# Altium schematic sheet Power.SchDoc
size A4; SheetNumber: 1; SheetTotal: 3
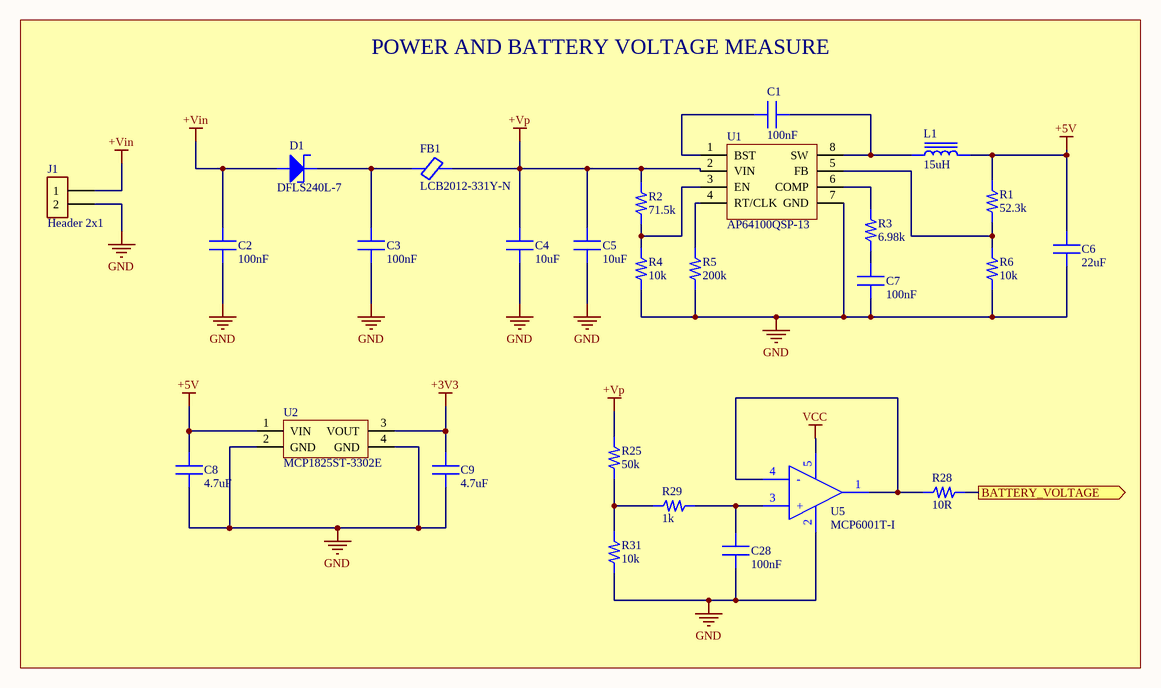
[diagram p0: Power.SchDoc]

## Parts
C1  100nF  [CAPC2012X145N 0805]
C2  100nF  [CAPC2012X145N 0805]
C3  100nF  [CAPC2012X145N 0805]
C4  10uF  [CAPC 1206 3216X180N]
C5  10uF  [CAPC 1206 3216X180N]
C6  22uF  [CAPC2012X145N 0805]
C7  100nF  [CAPC2012X145N 0805]
C8  4.7uF  [CAPC2012X145N 0805]
C9  4.7uF  [CAPC2012X145N 0805]
C28  100nF  [CAPC2012X145N 0805]
D1  DFLS240L-7  [DIODE DFLS240L-7  POWERDI 123]
FB1  LCB2012-331Y-N  [BEADC2012X105N MPZ2012S601ATD25]
J1  Header 2x1  [JST_B2B-PH-K-S 1x2 Header]
L1  15uH  [Inductor SRI1004-150M]
R1  52.3k  [RES 0805 YAGEO C2012X60N]
R2  71.5k  [RES 0805 YAGEO C2012X60N]
R3  6.98k  [RES 0805 YAGEO C2012X60N]
R4  10k  [RES 0805 YAGEO C2012X60N]
R5  200k  [RES 0805 YAGEO C2012X60N]
R6  10k  [RES 0805 YAGEO C2012X60N]
R25  50k  [RES 0805 YAGEO C2012X60N]
R28  10R  [RES 0805 YAGEO C2012X60N]
R29  1k  [RES 0805 YAGEO C2012X60N]
R31  10k  [RES 0805 YAGEO C2012X60N]
U1  AP64100QSP-13  [AP64100QSP-13 SOIC-8 Buck Converter]
U2  MCP1825ST-3302E  [LDO MCP1825ST-3302E/DB  SOT-223_3MC_MCH]
U5  MCP6001T-I  [MCP6001T-I/OT OPAMP SOT-23-5]

## Blocks framed on the sheet
POWER AND BATTERY VOLTAGE MEASURE: C1-C9 C28 D1 FB1 J1 L1 R1-R6 R25 R28 R29 R31 U1 U2 U5

## Ports
BATTERY_VOLTAGE (out, see MCU[1B])

## Nets
+3V3: C9.2 U2.3(VOUT)
+5V: C6.2 C8.2 L1.2 R1.2 U2.1(VIN)
+Vin: C2.2 D1.1(Anode) J1.1
+Vp: C4.2 C5.2 FB1.2 R2.2 R25.2 U1.2(VIN)
GND: C2.1 C3.1 C4.1 C5.1 C6.1 C7.1 C8.1 C9.1 C28.1 J1.2 R4.1 R5.1 R6.1 R31.1 U1.7(GND) U2.2(GND) U2.4(GND) U5.2(VSS)
VCC: U5.5(VDD)
BATTERY_VOLTAGE: R28.2 ; port BATTERY_VOLTAGE
NetC1_1: C1.1 U1.1(BST)
NetC1_2: C1.2 L1.1 U1.8(SW)
NetC3_2: C3.2 D1.2(Cathode) FB1.1
NetC7_2: C7.2 R3.1
NetC28_2: C28.2 R29.2 U5.3(+)
NetR1_1: R1.1 R6.2 U1.5(FB)
NetR2_1: R2.1 R4.2 U1.3(EN)
NetR3_2: R3.2 U1.6(COMP)
NetR5_2: R5.2 U1.4(RT/CLK)
NetR25_1: R25.1 R29.1 R31.2
NetR28_1: R28.1 U5.1(Vout) U5.4(-)

## Library data of the parts
C1 = CAP 0805 100nF: MLCC 0805 100nF 50VDC ±10% X7R; Manufacturer Code: CL21B104KBCNNNC; Manufacturer: SAMSUNG; Capacitance: 100nF; Voltage Rating: 50VDC; Dielectric: X7R; Package Size: 0805; Operating Temp.: -55 °C ~ +125 °C; Tolerance: ±10 %; Product Site: https://www.ozdisan.com/p/smt-smd-ve-mlcc-kapasitorler-184/samsung-cl21b104kbcnnnc-14777
C2 C3 C28 = CAP 0805 100nF CC0805JRX7R9BB104: MLCC 0805 100nF 50VDC ±10% X7R; Manufacturer: YAGEO; Tolerance: ±5 %; Capacitance: 100nF; Voltage Rating: 50VDC; Dielectric: X7R; Package Size: 0805; Operating Temp.: -55 °C ~ +125 °C; Manufacturer Code: CC0805JRX7R9BB104
  C2 C3: Product Site: https://www.ozdisan.com/p/smt-smd-ve-mlcc-kapasitorler-184/samsung-cl21b104kbcnnnc-14777
  C28: ComponentLink1Description: Product Site; ComponentLink1URL: https://www.ozdisan.com/p/smt-smd-ve-mlcc-kapasitorler-184/yageo-cc0805jrx7r9bb104-748830
C4 C5 = CAP 1206 10uF CL31A106KBHNNNE: MLCC (3216) 1206 10uF 50VDC ±10% X5R; Manufacturer: Samsung Electro-Mechanics; Manufacturer Product Number: CL31B225KCHSNNE; Package / Case: 1206; Operating Temperature: -55 °C ~ +85 °C; Temperature Coefficient: X5R; Voltage - Rated: 50 VDC; Tolerance: ±10%; Capacitance: 10 uF; ComponentLink1Description: Product Site; ComponentLink1URL: https://www.ozdisan.com/p/smt-smd-ve-mlcc-kapasitorler-184/samsung-cl31a106kbhnnne-437276
C6 = CAP 0805 22uF CL21A226KOQNNNE: MLCC (2012) 0805 22uF 16VDC ±10% X5R CL21A226KOQNNNE; Manufacturer: SAMSUNG; Voltage - Rated: 25V; Capacitance: 22 µF; ComponentLink1Description: Product Site; ComponentLink1URL: https://www.digikey.com/en/products/detail/tdk/C2012X5R1E226M125AC/3661564?s=N4IgTCBcDaIMJgAwEYwA0CsAlZBRMYAbALKoYCCIAugL5A; Package / Case: 0805 (2012 Metric); Operating Temperature: -55°C ~ 85°C; Temperature Coefficient: X5R; Tolerance: ±10 %; Manufacturer Product Number: CL21A226KOQNNNE
C7 = CAP 0805 10nF CC0805KRX7R9BB103: MLCC (2012) 0805 10nF 50VDC ±10% X7R; Manufacturer: YAGEO; Capacitance: 10nF; Voltage Rating: 50VDC; Dielectric: X7R; Package Size: 0805; Operating Temp.: -55 °C ~ +125 °C; Tolerance: ±10 %; Manufacturer Code: CC0805KRX7R9BB103; ComponentLink1Description: Product Site; ComponentLink1URL: https://www.ozdisan.com/p/smt-smd-ve-mlcc-kapasitorler-184/yageo-cc0805krx7r9bb103-534845
C8 C9 = CAP 0805 4.7uF CL21A475KAQNNNE: MLCC (2012) 0805 4.7uF 25VDC ±10% X5R; Manufacturer: SAMSUNG; Capacitance: 4.7uF; Voltage Rating: 25 VDC; Dielectric: X5R; Package Size: 0805; Operating Temp.: -55 °C ~ +125 °C; Tolerance: ±10 %; Manufacturer Product Number: CL21A475KAQNNNE; ComponentLink1Description: Product Site; ComponentLink1URL: https://www.ozdisan.com/p/smt-smd-ve-mlcc-kapasitorler-184/samsung-cl21a475kaqnnne-441542
D1 = DIODE SCHOTTKY DFLS240L-7: DIODE SCHOTTK 40V 2A POWERDI 123; Manufacturer: Diodes Incorporated; Capacitance @ Vr, F: 90pF @ 10V, 1MHz; Current - Reverse Leakage @ Vr: 100 µA @ 40 V; Voltage - Forward (Vf) (Max) @ If: 500 mV @ 2 A; Package / Case: POWERDI®123; Current - Average Rectified (Io): 2A; Voltage - DC Reverse: 40 V; Manufacturer Product Number: DFLS240L-7
FB1 = Ferrite Bead LCB2012-331Y-N: FERRITE BEAD 0805 330R/100MHZ SMD; Manufacturer: CORE MASTER; DC Resistance (DCR) (Max): 100mOhm; Current Rating (Max): 1.5A; Impedance @ Frequency: 330 Ohms @ 100 MHz; Package / Case: 0805 (2012 Metric); Operating Temperature: -55°C ~ 125°C; Manufacturer Product Number: LCB2012-331Y-N; ComponentLink1Description: Product Site; ComponentLink1URL: https://www.ozdisan.com/p/bead-feritler-469/core-master-lcb2012-331y-n-487985
J1 = Header 2x1 DS1066-2MVW6X: CON.T.B.2.00MM 2P 180C MALE CONNFLY; Voltage Rating: 100V; Current Rating (Amps): 2A; Pitch - Mating: 0.079" (2.00mm); Mounting Type: Through Hole; Contact Type: Male Pin; Series: PH; Manufacturer Product Number: DS1066-2MVW6X; Manufacturer: CONNFLY; ComponentLink1Description: Product Site; ComponentLink1URL: https://www.ozdisan.com/p/pcb-konnektorler-310/connfly-ds1066-2mvw6x-423540
L1 = 15uH Inductor SRI1004-150M: INDUCTOR POWER 15UH 10X10X4.5MM SMD; Manufacturer: CORE MASTER; DC Resistance (DCR): 80 m Ohms; Current Rating: 3.9 A; Tolerance: ±20 %; Mounting Type: SMT; Inductance: 15 uH; Manufacturer Product Number: SRI1004-150M; ComponentLink1Description: Product Site; ComponentLink1URL: https://www.ozdisan.com/p/sabit-induktorler-468/core-master-sri1004-150m-508899
R1 = RES 0805 52.3k 0805S8F5232T5E: RES.(2012) 0805 52.3K Ohms 1% 1/8W-S 100PPM; Manufacturer: ROYALOHM; Power: 1/8W; Max Working Current: 5A; Max Working Voltage: 150VDC; Resistance: 52.3k Ohms; Tolerance: ±1 %; Package / Case: 0805; Manufacturer Code: 0805S8F5232T5E; ComponentLink1Description: Product Site; ComponentLink1URL: https://www.ozdisan.com/p/smt-smd-ve-cip-direncler-194/royalohm-0805s8f5232t5e-505572
R2 = RES 0805 71.5k Ohms 0805S8F7152T5E: RES.(2012) 0805 71.5k Ohms 1% 1/8W-S 100PPM; Manufacturer: ROYALOHM; Power: 1/8W; Max Working Current: 5A; Max Working Voltage: 150; Resistance: 71.5k Ohms; Tolerance: ±1 %; Package / Case: 0805; Manufacturer Code: 0805S8F7152T5E; ComponentLink1Description: Product Site; ComponentLink1URL: https://www.digikey.com/en/products/detail/yageo/RC0805JR-07180RL/728263?_gl=1*zoghfp*_up*MQ..*_gs*MQ..&gclid=Cj0KCQjwrZTRBhDSARIsAHidYfd1C74hHvjrZ7UgtDa42yojQwh2zPzpseonp8MFHviGIzWBVsBX2EkaAnv4EALw_wcB&gclsrc=aw.ds&gbraid=0AAAAADrbLlgJKbqSaj2dwnRTRiMcVLJnx
R3 = RES 0805 6.98k 0805WAF6981T5E: RES.(2012) 0805 6.98K Ohms 1% 1/10W 100PPM; Manufacturer: ROYALOHM; Power: 1/8W; Max Working Current: 5A; Max Working Voltage: 150VDC; Resistance: 6.98k Ohms; Tolerance: ±1 %; Package / Case: 0805; Manufacturer Code: 0805WAF6981T5E; ComponentLink1Description: Product Site; ComponentLink1URL: https://www.digikey.com/en/products/detail/yageo/RC0805JR-07180RL/728263?_gl=1*zoghfp*_up*MQ..*_gs*MQ..&gclid=Cj0KCQjwrZTRBhDSARIsAHidYfd1C74hHvjrZ7UgtDa42yojQwh2zPzpseonp8MFHviGIzWBVsBX2EkaAnv4EALw_wcB&gclsrc=aw.ds&gbraid=0AAAAADrbLlgJKbqSaj2dwnRTRiMcVLJnx
R4 R6 R31 = RES 0805 10k 0805S8F1002T5E: RES.(2012) 0805 10K Ohms 1% 1/8W-S 100PPM; Manufacturer: ROYALOHM; Power: 1/8W; Max Working Current: 5A; Max Working Voltage: 150; Resistance: 10k Ohms; Tolerance: ±1 %; Package / Case: 0805; Manufacturer Code: 0805S8F1002T5E; ComponentLink1Description: Product Site
  R4 R6: ComponentLink1URL: https://www.digikey.com/en/products/detail/yageo/RC0805JR-07180RL/728263?_gl=1*zoghfp*_up*MQ..*_gs*MQ..&gclid=Cj0KCQjwrZTRBhDSARIsAHidYfd1C74hHvjrZ7UgtDa42yojQwh2zPzpseonp8MFHviGIzWBVsBX2EkaAnv4EALw_wcB&gclsrc=aw.ds&gbraid=0AAAAADrbLlgJKbqSaj2dwnRTRiMcVLJnx
  R31: ComponentLink1URL: https://www.ozdisan.com/p/smt-smd-ve-cip-direncler-194/royalohm-0805s8f1002t5e-30240
R5 = RES 0805 200k 0805S8F2003T5E: RES.(2012) 0805 200K Ohms 1% 1/8W-S 100PPM; Manufacturer: ROYALOHM; Power: 1/8W; Max Working Current: 5A; Max Working Voltage: 150VDC; Resistance: 200k Ohms; Tolerance: ±1 %; Package / Case: 0805; Manufacturer Code: 0805S8F2003T5E; ComponentLink1Description: Product Site; ComponentLink1URL: https://www.ozdisan.com/p/smt-smd-ve-cip-direncler-194/royalohm-0805s8f2003t5e-465323
R25 = RES 0805 50k 0805S8F5002T5E: RES.(2012) 0805 50K Ohms 1% 1/8W-S 100PPM; Manufacturer: ROYALOHM; Power: 1/8W; Max Working Current: 5A; Max Working Voltage: 150; Resistance: 50 kOhms; Tolerance: ±1 %; Package / Case: 0805; Manufacturer Code: 0805S8F5002T5E; ComponentLink1Description: Product Site; ComponentLink1URL: https://www.ozdisan.com/p/smt-smd-ve-cip-direncler-194/royalohm-0805s8f5002t5e-343425
R28 = RES 0805 10 Ohms 0805S8J0100T5E: RES.(2012) 0805 10 Ohms 5% 1/8W-S 400PPM; Manufacturer: ROYALOHM; Resistance: 10 Ohms; Power: 1/8W; Tolerance: ±1 %; Max Working Current: 5A; Max Working Voltage: 150VDC; Package / Case: 0805; Manufacturer Code: 0805S8J0100T5E; ComponentLink1Description: Product Site; ComponentLink1URL: https://www.ozdisan.com/p/smt-smd-ve-cip-direncler-194/royalohm-0805s8j0100t5e-29704
R29 = RES 0805 1k Ohms 0805S8F1001TDE: RES.(2012) 0805 1K Ohms 1% 1/8W-S 100PPM; Manufacturer: ROYALOHM; Resistance: 1k Ohms; Power: 1/8W; Max Working Current: 5A; Max Working Voltage: 150VDC; Tolerance: ±1 %; Package / Case: 0805; Manufacturer Code: 0805S8F1001TDE; ComponentLink1Description: Product Site; ComponentLink1URL: https://www.ozdisan.com/p/smt-smd-ve-cip-direncler-194/royalohm-0805s8f1001tde-356631
U1 = AP64100QSP-13 Buck converter: Buck Switching Regulator IC Positive Adjustable 0.8V 1 Output 1A 8-SOIC (0.154", 3.90mm Width) Exposed Pad; Manufacturer: Diodes Incorporated; Frequency - Switching: 500kHz, 100kHz ~ 2.2MHz; Voltage - Output (Max): 40V; Voltage - Input (Min): 3.8V; Function: Step-Down; ComponentLink1Description: Product Site; ComponentLink1URL: https://www.ozdisan.com/p/dc-dc-voltaj-regulatorleri-275/diodes-ap64100qsp-13-994353; Package / Case: SOIC-8; Operating Temperature: -40°C ~ 125°C (TA); Current - Output: 1A; Voltage - Output (Min/Fixed): 0.8V; Voltage - Input (Max): 40V; Manufacturer Product Number: AP64100QSP-13
U2 = LDO 3V3 MCP1825ST-3302E/DB: Linear Voltage Regulator IC Positive Fixed 1 Output 500mA SOT-223-3; Manufacturer: Microchip Technology; PSRR: 60dB (100Hz); Voltage Dropout (Max): 0.35V @ 500mA; Voltage - Output (Min/Fixed): 3.3V; Voltage - Input (Max): 6V; ComponentLink1Description: Product Site; ComponentLink1URL: https://www.digikey.com/en/products/detail/microchip-technology/MCP1825ST-3302E-DB/1635518; Package / Case: SOT-223-3; Current - Output: 500mA; Operating Temperature: -40°C ~ 125°C; Manufacturer Product Number: MCP1825ST-3302E/DB
U5 = MCP6001T-I/OT OP-AMP 1 CH LOW POWER: Standard (General Purpose) Amplifier 1 Circuit Rail-to-Rail SOT-23-5; Manufacturer: Microchip Technology; Voltage - Supply Span (Min) - (Max): 1.8V to 6V; Voltage - Input Offset: 4.5 mV; Current - Output / Channel: 23 mA; Current - Supply: 100µA; Gain Bandwidth Product: 1 MHz; Operating Temperature: -40°C ~ 85°C; Output Type: Rail-to-Rail; Manufacturer Product Number: MCP6001T-I/OT; Package / Case: SOT-23-5; ComponentLink1Description: Product Site; ComponentLink1URL: https://www.ozdisan.com/p/amplifikatorler-242/microchip-mcp6001t-i-ot-40820